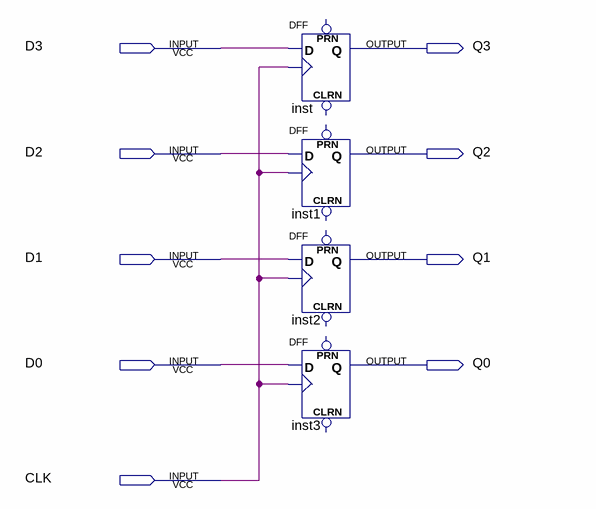
[diagram p0: schematic sheet]
// Quartus schematic DFFs.bdf as structural Verilog: 4 symbols, 9 pins
module DFFs (
  input  D3,
  input  D2,
  input  D1,
  input  D0,
  input  CLK,
  output Q3,
  output Q2,
  output Q1,
  output Q0
);

  DFF inst (.CLK(CLK), .D(D3), .Q(Q3));  // open: CLRN, PRN
  DFF inst1 (.CLK(CLK), .D(D2), .Q(Q2));  // open: CLRN, PRN
  DFF inst2 (.CLK(CLK), .D(D1), .Q(Q1));  // open: CLRN, PRN
  DFF inst3 (.CLK(CLK), .D(D0), .Q(Q0));  // open: CLRN, PRN
endmodule
